# Altium schematic sheet STM32_DAQ_Control_Board.SchDoc
size 297 x 209 mm; Symbol: Drawing-Symbol_A4; Company: 嘉立创EDA; Version: V1.0; Page Size: A4; @Project Name: stm32系统版; @Update Date: 2026-07-07; @Create Date: 2026-07-07; Device: Drawing-Symbol_A4; @Board Name: Board1; @Page Name: P1; @Create Time: 19:32:34; @Page Count: 1; @Page No: 1; @Schematic Name: Schematic1; @Update Time: 19:32:34; @Assembly Variant: Basic; Border: 1; Title Block Position: 3; Size: A4; Width: 1170; Height: 825; Region Start: 1; X Region Count: 6; Y Region Count: 4; Blade Width: 10; SheetNumber: 1; SheetTotal: 1
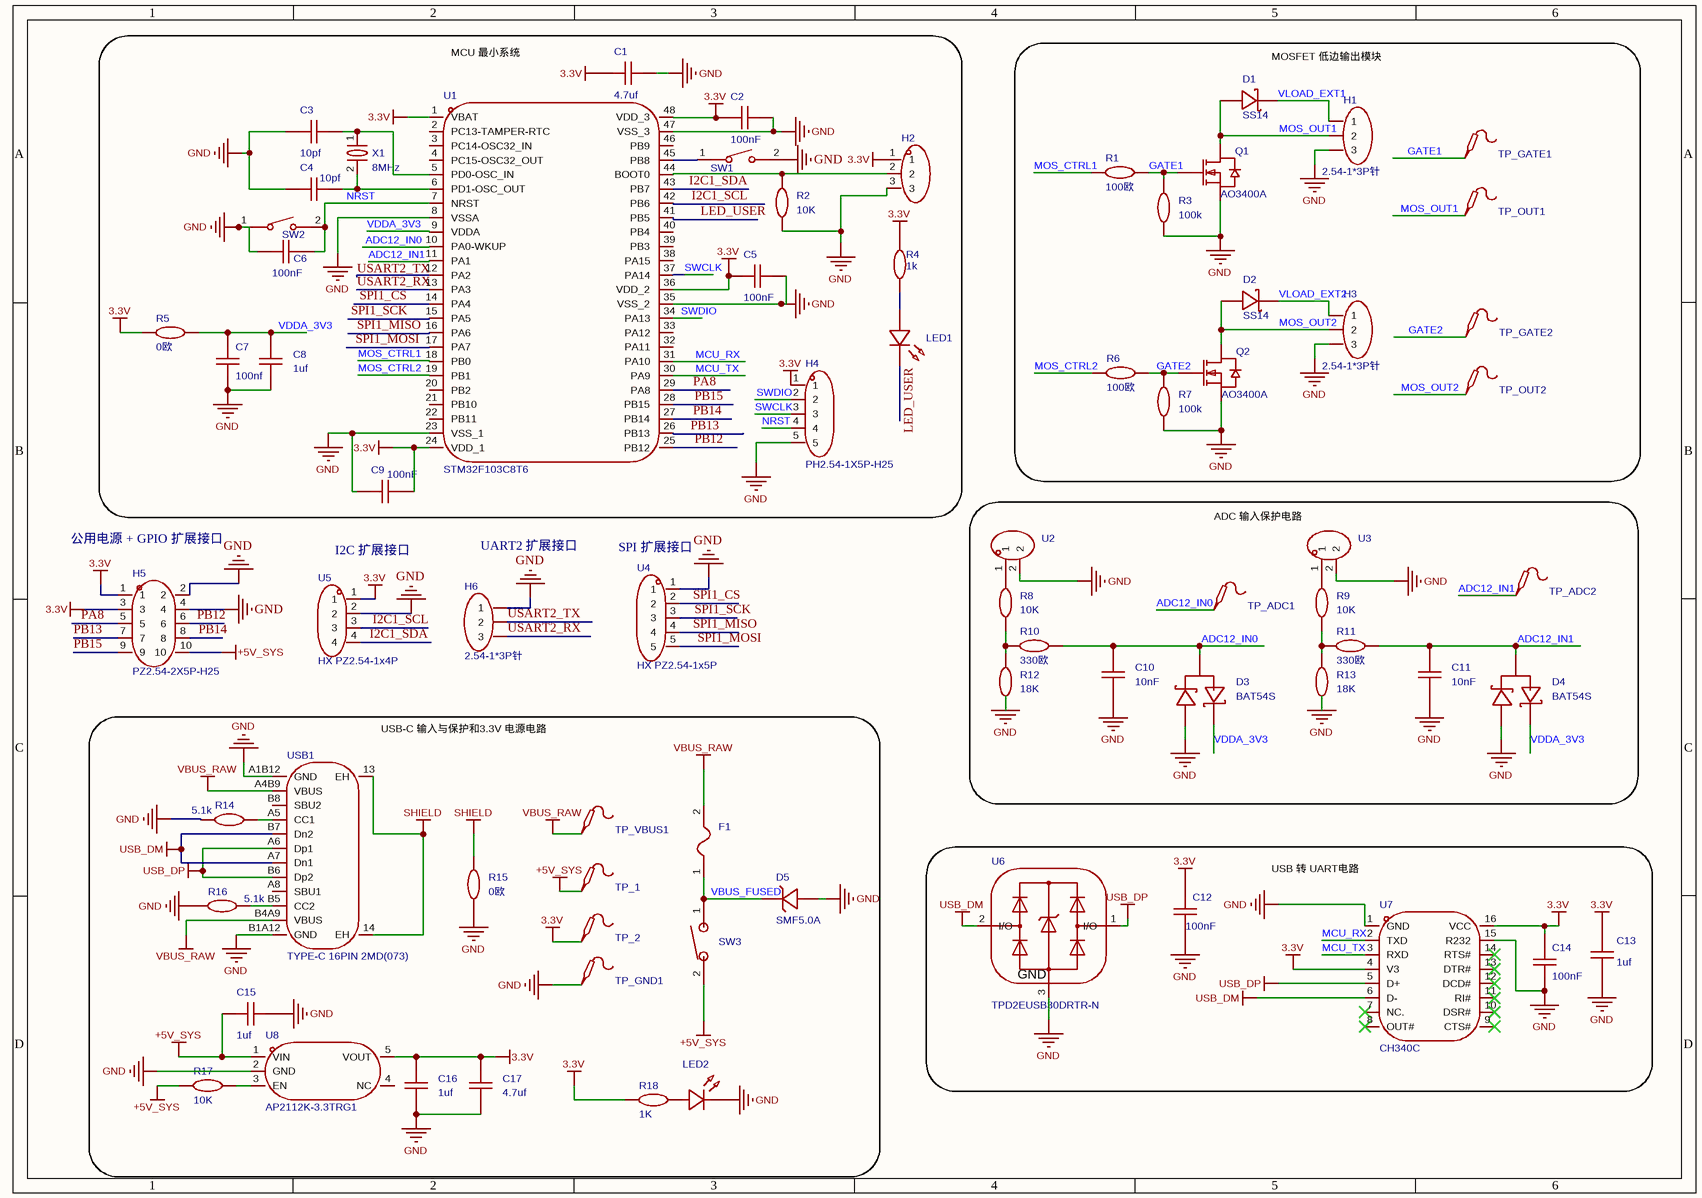
[diagram p0: STM32_DAQ_Control_Board.SchDoc]

## Parts
C1  4.7uf  [C0603]
C2  100nF  [C0603]
C3  10pf  [C0603]
C4  10pf  [C0603]
C5  100nF  [C0603]
C6  100nF  [C0603]
C7  100nf  [C0603]
C8  1uf  [C0603]
C9  100nF  [C0603]
C10  10nF  [C0603]
C11  10nF  [C0603]
C12  100nF  [C0603]
C13  1uf  [C0603]
C14  100nF  [C0603]
C15  1uf  [C0603]
C16  1uf  [C0603]
C17  4.7uf  [C0603]
D1  SS14  [SMA_L4.3-W2.6-LS5.2-RD]
D2  SS14  [SMA_L4.3-W2.6-LS5.2-RD]
D3  BAT54S  [SOT-23-3_L2.9-W1.3-P1.90-LS2.4-BR]
D4  BAT54S  [SOT-23-3_L2.9-W1.3-P1.90-LS2.4-BR]
D5  SMF5.0A  [SOD-123FL_L2.7-W1.8-LS3.8-RD]
F1  SMD0805-050-6  [F0805]  (value not drawn)
H1  2.54-1*3P针  [HDR-TH_3P-P2.54-V-M-1]
H2  HX PZ2.54-1x3P ZZ  [CONN-TH_HX-PZ2.54-1X3P-ZZ]  (value not drawn)
H3  2.54-1*3P针  [HDR-TH_3P-P2.54-V-M-1]
H4  PH2.54-1X5P-H25  [HDR-TH_5P-P2.54-V-M-3]
H5  PZ2.54-2X5P-H25  [HDR-TH_10P-P2.54-V-M-R2-C5-S2.54_2]
H6  2.54-1*3P针  [HDR-TH_3P-P2.54-V-M-1]
LED1  GL0603UR01  [LED0603-FD]  (value not drawn)
LED2  GL0603UR01  [LED0603-FD]  (value not drawn)
Q1  AO3400A  [SOT-23-3_L2.9-W1.3-P1.90-LS2.4-BR]
Q2  AO3400A  [SOT-23-3_L2.9-W1.3-P1.90-LS2.4-BR]
R1  100欧  [R0603]
R2  10K  [R0603]
R3  100k  [R0603]
R4  1k  [R0603]
R5  0欧  [R0603]
R6  100欧  [R0603]
R7  100k  [R0603]
R8  10K  [R0603]
R9  10K  [R0603]
R10  330欧  [R0603]
R11  330欧  [R0603]
R12  18K  [R0603]
R13  18K  [R0603]
R14  5.1k  [R0603]
R15  0欧  [R0603]
R16  5.1k  [R0603]
R17  10K  [R0603]
R18  1K  [R0603]
SW1  TS-1088-AR02016  [SW-SMD_L3.9-W3.0-P4.45]  (value not drawn)
SW2  TS-1088-AR02016  [SW-SMD_L3.9-W3.0-P4.45]  (value not drawn)
SW3  RS601HL-1010011BB  [SW-TH_RS601HL-1010011BB]  (value not drawn)
TP_1  (no value)  [Test-Point-0.5mm]
TP_2  (no value)  [Test-Point-0.5mm]
TP_ADC1  (no value)  [Test-Point-0.5mm]
TP_ADC2  (no value)  [Test-Point-0.5mm]
TP_GATE1  (no value)  [Test-Point-0.5mm]
TP_GATE2  (no value)  [Test-Point-0.5mm]
TP_GND1  (no value)  [Test-Point-0.5mm]
TP_OUT1  (no value)  [Test-Point-0.5mm]
TP_OUT2  (no value)  [Test-Point-0.5mm]
TP_VBUS1  (no value)  [Test-Point-0.5mm]
U1  STM32F103C8T6  [LQFP-48_L7.0-W7.0-P0.50-LS9.0-BL]
U2  HX PZ2.54-1x2P ZZ  [HDR-TH_2P-P2.54-V-M-3]  (value not drawn)
U3  HX PZ2.54-1x2P ZZ  [HDR-TH_2P-P2.54-V-M-3]  (value not drawn)
U4  HX PZ2.54-1x5P  [HDR-TH_5P-P2.54-V-M]
U5  HX PZ2.54-1x4P  [HDR-TH_4P-P2.54-V-M]
U6  TPD2EUSB30DRTR-N  [SOT-723_L1.2-W0.8-P0.40-LS1.2-BR]
U7  CH340C  [SOP-16_L10.0-W3.9-P1.27-LS6.0-BL]
U8  AP2112K-3.3TRG1  [SOT-25-5_L2.9-W1.6-P0.95-LS2.8-BL]
USB1  TYPE-C 16PIN 2MD(073)  [USB-C-SMD_TYPE-C-16PIN-2MD-073]
X1  8MHz  [CRYSTAL-SMD_L5.0-W3.2]

## Blocks framed on the sheet
MCU 最小系统: C1-C9 H2 H4 LED1 R2 R4 R5 SW1 SW2 U1 X1
MOSFET 低边输出模块: D1 D2 H1 H3 Q1 Q2 R1 R3 R6 R7 TP_GATE1 TP_GATE2 TP_OUT1 TP_OUT2
ADC 输入保护电路: C10 C11 D3 D4 R8-R13 TP_ADC1 TP_ADC2 U2 U3
USB-C 输入与保护和3.3V 电源电路: C15-C17 D5 F1 LED2 R14-R18 SW3 TP_1 TP_2 TP_GND1 TP_VBUS1 U8 USB1
USB 转 UART电路: C12-C14 U6 U7

## Nets
3.3V: C1.2 C2.1 C5.1 C9.2 C12.2 C13.2 C14.2 C16.1 C17.1 H2.1 H4.1 H5.1 H5.3 R4.2 R5.1 R18.2 TP_2.1 U1.1(VBAT) U1.24(VDD_1) U1.36(VDD_2) U1.48(VDD_3) U5.1 U7.4(V3) U7.16(VCC) U8.5(VOUT)
+5V_SYS: C15.1 H5.10 R17.1 SW3.2 TP_1.1 U8.1(VIN)
GND: C1.1 C2.2 C3.1 C4.1 C5.2 C6.1 C7.1 C8.1 C9.1 C10.1 C11.1 C12.1 C13.1 C14.1 C15.2 C16.2 C17.2 D3.1(K1) D4.1(K1) D5.2(A) H1.3 H2.3 H3.3 H4.5 H5.2 H5.4 H6.1 LED2.2(C) Q1.2(S) Q2.2(S) R2.2 R3.1 R7.1 R12.2 R13.2 R14.1 R15.1 R16.1 SW1.2 SW2.1 TP_GND1.1 U1.8(VSSA) U1.23(VSS_1) U1.35(VSS_2) U1.47(VSS_3) U2.2 U3.2 U4.1 U5.2 U6.3(GND) U7.1(GND) U7.15(R232) U8.2(GND) USB1.A1B12(GND) USB1.B1A12(GND)
SHIELD: R15.2 USB1.13(EH) USB1.14(EH)
USB_DM: U6.2(I/O) U7.6(D-) USB1.A7(Dn1) USB1.B7(Dn2)
USB_DP: U6.1(I/O) U7.5(D+) USB1.A6(Dp1) USB1.B6(Dp2)
VBUS_RAW: F1.2 TP_VBUS1.1 USB1.A4B9(VBUS) USB1.B4A9(VBUS)
ADC12_IN0: C10.2 D3.3(A) R10.1 TP_ADC1.1 U1.10(PA0-WKUP)
ADC12_IN1: C11.2 D4.3(A) R11.1 TP_ADC2.1 U1.11(PA1)
GATE1: Q1.1(G) R1.2 R3.2 TP_GATE1.1
GATE2: Q2.1(G) R6.2 R7.2 TP_GATE2.1
I2C1_SCL: U1.42(PB6) U5.3
I2C1_SDA: U1.43(PB7) U5.4
LED_USER: LED1.2(C) U1.41(PB5)
MCU_RX: U1.31(PA10) U7.2(TXD)
MCU_TX: U1.30(PA9) U7.3(RXD)
MOS_CTRL1: R1.1 U1.18(PB0)
MOS_CTRL2: R6.1 U1.19(PB1)
MOS_OUT1: D1.2(A) H1.2 Q1.3(D) TP_OUT1.1
MOS_OUT2: D2.2(A) H3.2 Q2.3(D) TP_OUT2.1
NRST: C6.2 H4.4 SW2.2 U1.7(NRST)
PA8: H5.5 U1.29(PA8)
PB12: H5.6 U1.25(PB12)
PB13: H5.7 U1.26(PB13)
PB14: H5.8 U1.27(PB14)
PB15: H5.9 U1.28(PB15)
SPI1_CS: U1.14(PA4) U4.2
SPI1_MISO: U1.16(PA6) U4.4
SPI1_MOSI: U1.17(PA7) U4.5
SPI1_SCK: U1.15(PA5) U4.3
SWCLK: H4.3 U1.37(PA14)
SWDIO: H4.2 U1.34(PA13)
USART2_RX: H6.3 U1.13(PA3)
USART2_TX: H6.2 U1.12(PA2)
VBUS_FUSED: D5.1(K) F1.1 SW3.1
VDDA_3V3: C7.2 C8.2 D3.2(K2) D4.2(K2) R5.2 U1.9(VDDA)
VLOAD_EXT1: D1.1(K) H1.1
VLOAD_EXT2: D2.1(K) H3.1
NetC3_2: C3.2 U1.5(PD0-OSC_IN) X1.1
NetC4_2: C4.2 U1.6(PD1-OSC_OUT) X1.2(GND)
NetH2_2: H2.2 R2.1 U1.44(BOOT0)
NetLED1_1: LED1.1(A) R4.1
NetR8_1: R8.1 U2.1
NetR8_2: R8.2 R10.2 R12.1
NetR9_1: R9.1 U3.1
NetR9_2: R9.2 R11.2 R13.1
NetR14_2: R14.2 USB1.A5(CC1)
NetR16_2: R16.2 USB1.B5(CC2)
NetR17_2: R17.2 U8.3(EN)
NetSW1_1: SW1.1 U1.45(PB8)

Not connected (* = marked no-connect by the designer): LED2 1(A); R18 1; U1 2(PC13-TAMPER-RTC) 3(PC14-OSC32_IN) 4(PC15-OSC32_OUT) 20(PB2) 21(PB10) 22(PB11) 32(PA11) 33(PA12) 38(PA15) 39(PB3) 40(PB4) 46(PB9); U7 7(NC.)* 8(OUT#)* 9(CTS#)* 10(DSR#)* 11(RI#)* 12(DCD#)* 13(DTR#)* 14(RTS#)*; U8 4(NC); USB1 A8(SBU1) B8(SBU2)

## Notes on the sheet
- (near H5) 公用电源 + GPIO 扩展接口
- I2C 扩展接口
- (near H6) UART2 扩展接口
- (near U4) SPI 扩展接口

## Library data of the parts
C1-C9 C15-C17 = CAP_0603: Symbol: Capacitance; ConvertToPcb: yes; ModelId: ac125912035d415993ca9572d50418b1聨0819f05c4eef4c71ace90d822a990e87; ModelName: C0603_L1.6-W0.8-H0.8; ModelTransform: 62.992,31.496,0,0,0,0,0,0,0; Device: CAP_0603; AddInBom: yes; Supplier Footprint: 0603; FootprintName: C0603
  C1 C17: Value: 4.7uf
  C2 C5 C6 C9: Value: 100nF
  C3 C4: Value: 10pf
  C7: Value: 100nf
  C8 C15 C16: Value: 1uf
C10-C14 = CAP_0603: Symbol: Capacitance; 3D Model: ac125912035d415993ca9572d50418b1聨0819f05c4eef4c71ace90d822a990e87; 3D Model Transform: 62.992,31.496,0,0,0,0,0,0,0; ConvertToPcb: yes; ModelName: C0603_L1.6-W0.8-H0.8; Device: CAP_0603; Supplier Footprint: 0603; AddInBom: yes; FootprintName: C0603
  C10 C11: Value: 10nF
  C12 C14: Value: 100nF
  C13: Value: 1uf
D1 D2 = SS14_C83852: 正向压降(Vf):500mV@1A;直流反向耐压(Vr):40V;整流电流:1A;; Manufacturer: onsemi(安森美); AddInBom: yes; ModelId: e3551acb3c5a4975a5e9d36087fe1fa2聨0819f05c4eef4c71ace90d822a990e87; ModelTransform: 185.039,102.362,0,0,0,0,0,0,0; Voltage - DC Reverse(Vr): 40V; Current - Rectified: 1A; Reverse Leakage Current (Ir): 200uA@40V; Operating Junction Temperature Range: -65℃~+125℃; Non-Repetitive Peak Forward Surge Current: 40A; Symbol: SS14_C83852; Device: SS14_C83852; LCSC Part Name: 电压:40V 电流:1A; SupplierPart: C83852; ManufacturerPart: SS14; Supplier Footprint: SMA(DO-214AC); JLCPCB Part Class: Extended Part; Datasheet: https://item.szlcsc.com/datasheet/SS14/85019.html; Supplier: LCSC; ConvertToPcb: yes; FootprintName: SMA_L4.3-W2.6-LS5.2-RD; ModelName: SMA_L4.3-W2.6-LS5.2-RD; Voltage - Forward(Vf@If): 500mV@1A
D3 D4 = BAT54S_C7420333: 二极管配置:1对串联式;正向压降(Vf):400mV@10mA;直流反向耐压(Vr):30V;整流电流:200mA;; Manufacturer: R+O(宏嘉诚); AddInBom: yes; ModelId: c62791f0466c4ae2a892c056b845b0ca聨0819f05c4eef4c71ace90d822a990e87; ModelName: SOT-23-3P_L2.9-W1.3-H1.0-LS2.4-P0.95; ModelTransform: 98.425,114.173,0,180,0,0,0.0005,-0.0005,0; Diode Configuration: 1对串联式; Voltage - DC Reverse(Vr): 30V; Current - Rectified: 200mA; Reverse Leakage Current (Ir): 2uA@30V; Non-Repetitive Peak Forward Surge Current: 600mA; Symbol: BAT54S_C7420333; Device: BAT54S_C7420333; LCSC Part Name: 电压:30V 电流:200mA; SupplierPart: C7420333; ManufacturerPart: BAT54S; Supplier Footprint: SOT-23; JLCPCB Part Class: Extended Part; Datasheet: https://item.szlcsc.com/datasheet/BAT54S/8397155.html; Supplier: LCSC; ConvertToPcb: yes; FootprintName: SOT-23-3_L2.9-W1.3-P1.90-LS2.4-BR; Voltage - Forward(Vf@If): 400mV@10mA
D5 = SMF5.0A_C19077497: 极性:单向;反向截止电压(Vrwm):5V;钳位电压:9.2V;峰值脉冲电流(Ipp):21.7A@10/1000us;峰值脉冲功率(Ppp):200W@10/1000us;击穿电压:7V;; Manufacturer: R+O(宏嘉诚); AddInBom: yes; ModelId: 86f9151e155e4fe2af0c4f2e0a80302e聨0819f05c4eef4c71ace90d822a990e87; ModelName: SOD-123FL_L2.8-W1.8-H1.1-LS3.6; ModelTransform: 141.732,70.866,0,180,0,0,0,0,0; Polarity: 单向; Reverse Stand-Off Voltage (Vrwm): 5V; Clamping Voltage: 9.2V; Voltage - Breakdown: 7V; Reverse Leakage Current (Ir): 400uA; Number of Channels: 单路; level of protection: IEC 61000-4-2; Type: TVS; Symbol: SMF5.0A_C19077497; Device: SMF5.0A_C19077497; LCSC Part Name: 单向TVS 5V截止 峰值浪涌电流：21.7A@10/1000us; SupplierPart: C19077497; ManufacturerPart: SMF5.0A; Supplier Footprint: SOD-123FL; JLCPCB Part Class: Extended Part; Datasheet: https://item.szlcsc.com/datasheet/SMF5.0A/20275582.html; Supplier: LCSC; ConvertToPcb: yes; FootprintName: SOD-123FL_L2.7-W1.8-LS3.8-RD; Peak Pulse Current (Ipp): 21.7A@10/1000us; Peak Pulse Power Dissipation (Ppp): 200W@10/1000us; Operating Temperature: -55℃~+150℃; Junction Capacitance: -
F1 = SMD0805-050-6: 耐压(Vmax):6V;最大电流(Imax):40A;保持电流(Ihold):500mA;跳闸电流(Itrip):1A;; Manufacturer: R+O(宏嘉诚); AddInBom: yes; ModelId: 57e2aa106f9143e8b6ab832aebb31c78聨0819f05c4eef4c71ace90d822a990e87; ModelName: F0805_L2.1-W1.4-H0.8; ModelTransform: 82.677,55.118,0,0,0,0,0.0005,0,0; Voltage - Max: 6V; Current - Max: 40A; Hold Current: 500mA; Trip Current: 1A; Power Dissipation: 500mW; Resistance - Initial (Ri) (Min): 100mΩ; Resistance - Post Trip (R1) (Max): 850mΩ; Time to Trip(Max): 100ms; Symbol: SMD0805-050-6; Device: SMD0805-050-6; LCSC Part Name: 6V 500mA; SupplierPart: C46640983; ManufacturerPart: SMD0805-050-6; Supplier Footprint: 0805; JLCPCB Part Class: Extended Part; Datasheet: https://item.szlcsc.com/datasheet/SMD0805-050-6/48798689.html; Supplier: LCSC; ConvertToPcb: yes; FootprintName: F0805; Operating Temperature: -40℃~+85℃; Length: 2.2mm; Width: 1.5mm; Height: 0.8mm
H1 H3 H6 = 2.54-1*3P针: 插针结构:1x3P;间距:2.54mm;行距:-;圆针/方针:方针;安装方式:直插;排数:单排;总PIN位数:3P;额定电流:3A;额定电压:-;配合针长度:6mm;塑高:2.5mm;端接针长度:3mm;触头材质:黄铜;触头镀层:金;工作温度:-40℃~+105℃;颜色:黑色;; Manufacturer: BOOMELE(博穆精密); Symbol: Header-Male-2.54_1x3; AddInBom: yes; ModelId: 94a8ffe137b6410295cb18cd3ffd99db聨0819f05c4eef4c71ace90d822a990e87; ModelName: HDR-M-2.54_1x3; ModelTransform: 299.9994,100,0,0,0,0,0,0,-118.11; Pin Structure: 1x3P; Pitch: 2.54mm; Circluar Pins/Square Pins: 方针; Current Rating: 3A; Device: 2.54-1*3P针; LCSC Part Name: 1x3P 间距:2.54mm 方针 直插; SupplierPart: C49257; ManufacturerPart: 2.54-1*3P针; Supplier Footprint: 插件,P=2.54mm; JLCPCB Part Class: Extended Part; Datasheet: https://item.szlcsc.com/datasheet/2.54-1*3P%25E9%2592%2588/50265.html; Supplier: LCSC; ConvertToPcb: yes; FootprintName: HDR-TH_3P-P2.54-V-M-1; Row Spacing: -; Mounting Type: 直插; Number of Rows: 单排; Number of Pins: 3P; Voltage Rating (Max): -; Length of Mating Pin: 6mm; Insulation Height: 2.5mm; Length of End Connection Pin: 3mm; Contact Material: 黄铜; Contact Plating: 金; Operating Temperature: -40℃~+105℃; Color: 黑色
H2 = HX PZ2.54-1x3P ZZ: 插针结构:1x3P;间距:2.54mm;行距:-;圆针/方针:方针;安装方式:直插;排数:单排;总PIN位数:3P;额定电流:3A;额定电压:1kV;配合针长度:6mm;塑高:2.5mm;端接针长度:3mm;触头材质:黄铜;触头镀层:金;工作温度:-40℃~+105℃;颜色:黑色;; Manufacturer: hanxia(韩下); AddInBom: yes; ModelId: d100cf23e3504114ab0fced37a4e4a82聨0819f05c4eef4c71ace90d822a990e87; ModelTransform: 292.5191,98.425,0,0,0,0,0,0,-118.11; Pin Structure: 1x3P; Pitch: 2.54mm; Circluar Pins/Square Pins: 方针; Current Rating: 3A; Voltage Rating (Max): 1kV; Symbol: HX PZ2.54-1X3P ZZ; Device: HX PZ2.54-1x3P ZZ; LCSC Part Name: 1x3P 间距:2.54mm 方针 直插; SupplierPart: C32713269; ManufacturerPart: HX PZ2.54-1x3P ZZ; Supplier Footprint: 插件,P=2.54mm; JLCPCB Part Class: Extended Part; Datasheet: https://item.szlcsc.com/datasheet/HX%2520PZ2.54-1x3P%2520ZZ/34444549.html; Supplier: LCSC; ConvertToPcb: yes; FootprintName: CONN-TH_HX-PZ2.54-1X3P-ZZ; ModelName: CONN-TH_HX-PZ2.54-1X3P-ZZ; Row Spacing: -; Mounting Type: 直插; Number of Rows: 单排; Number of Pins: 3P; Length of Mating Pin: 6mm; Insulation Height: 2.5mm; Length of End Connection Pin: 3mm; Contact Material: 黄铜; Contact Plating: 金; Operating Temperature: -40℃~+105℃; Color: 黑色; Supplementary Features: -
H4 = PH2.54-1X5P-H25: 插针结构:1x5P;间距:2.54mm;行距:-;圆针/方针:方针;安装方式:直插;排数:单排;总PIN位数:5P;额定电流:3A;额定电压:-;配合针长度:6mm;塑高:2.5mm;端接针长度:3mm;触头材质:黄铜;触头镀层:金;工作温度:-40℃~+105℃;颜色:黑色;; Manufacturer: JXTCONN(聚兴泰); AddInBom: yes; ModelId: 70c2fce3a47c4ce6bc0418a805e76a28聨0819f05c4eef4c71ace90d822a990e87; ModelTransform: 500.3927,98.425,0,0,0,0,0,0,-118.11; Pin Structure: 1x5P; Pitch: 2.54mm; Circluar Pins/Square Pins: 方针; Current Rating: 3A; Symbol: PH2.54-1X5P-H25; Device: PH2.54-1X5P-H25; LCSC Part Name: 1x5P 间距:2.54mm 方针 直插; SupplierPart: C42431835; ManufacturerPart: PH2.54-1X5P-H25; Supplier Footprint: 插件,P=2.54mm; JLCPCB Part Class: Extended Part; Datasheet: https://item.szlcsc.com/datasheet/PH2.54-1X5P-H25/44458965.html; Supplier: LCSC; ConvertToPcb: yes; FootprintName: HDR-TH_5P-P2.54-V-M-3; ModelName: HDR-TH_5P-P2.54-V-M-3; Row Spacing: -; Mounting Type: 直插; Number of Rows: 单排; Number of Pins: 5P; Voltage Rating (Max): -; Length of Mating Pin: 6mm; Insulation Height: 2.5mm; Length of End Connection Pin: 3mm; Contact Material: 黄铜; Contact Plating: 金; Operating Temperature: -40℃~+105℃; Color: 黑色
H5 = PZ2.54-2X5P-H25: 插针结构:2x5P;间距:2.54mm;行距:2.54mm;圆针/方针:方针;安装方式:直插;排数:双排;总PIN位数:10P;额定电流:3A;额定电压:-;配合针长度:6mm;塑高:2.5mm;端接针长度:3mm;触头材质:黄铜;触头镀层:金;工作温度:-40℃~+105℃;颜色:黑色;; Manufacturer: JXTCONN(聚兴泰); AddInBom: yes; ModelId: 06d0967b89884158823d1be712bed3d1聨0819f05c4eef4c71ace90d822a990e87; ModelTransform: 500.393,200,0,0,0,0,0,0,-196.85; Pin Structure: 2x5P; Pitch: 2.54mm; Circluar Pins/Square Pins: 方针; Current Rating: 3A; Symbol: PZ2.54-2X5P-H25; Device: PZ2.54-2X5P-H25; LCSC Part Name: 2x5P 间距:2.54mm 方针 直插; SupplierPart: C42431818; ManufacturerPart: PZ2.54-2X5P-H25; Supplier Footprint: 插件,P=2.54mm; JLCPCB Part Class: Extended Part; Datasheet: https://item.szlcsc.com/datasheet/PZ2.54-2X5P-H25/44458948.html; Supplier: LCSC; ConvertToPcb: yes; FootprintName: HDR-TH_10P-P2.54-V-M-R2-C5-S2.54_2; ModelName: HDR-TH_10P-P2.54-V-M-R2-C5-S2.54_2; Row Spacing: 2.54mm; Mounting Type: 直插; Number of Rows: 双排; Number of Pins: 10P; Voltage Rating (Max): -; Length of Mating Pin: 6mm; Insulation Height: 2.5mm; Length of End Connection Pin: 3mm; Contact Material: 黄铜; Contact Plating: 金; Operating Temperature: -40℃~+105℃; Color: 黑色
LED1 LED2 = GL0603UR01: 灯头类型:-;发光颜色:红色;正向压降(Vf):2.4V;功率:-;正向电流:20mA;波长:620nm~625nm;二极管配置:独立二极管;透镜颜色:无色透明透镜;色温:-;发光强度:120mcd;发光角度:120°;载带方式:正贴;工作温度:-40℃~+85℃;; Manufacturer: Guiguang light(桂光光电); AddInBom: yes; ModelId: b57d6965da4c4e30afc1a994a1f136ae聨0819f05c4eef4c71ace90d822a990e87; ModelName: LED0603_Inf; ModelTransform: 60,30,0,0,0,0,0,0,0; Illumination Color: 红色; Voltage - Forward(Vf): 2.4V; Forward Current: 20mA; Diode Configuration: 独立二极管; Lens Color: 无色透明透镜; Luminous Intensity: 120mcd; Viewing Angle: 120°; Symbol: GL0603UR01; Device: GL0603UR01; LCSC Part Name: 0603 红灯 高亮; SupplierPart: C51933292; ManufacturerPart: GL0603UR01; Supplier Footprint: 0603; JLCPCB Part Class: Extended Part; Datasheet: https://item.szlcsc.com/datasheet/GL0603UR01/54645988.html; Supplier: LCSC; ConvertToPcb: yes; FootprintName: LED0603-FD; Lamp Holder Type: -; Power(Watts): -; Wavelength - Dominant: 620nm~625nm; Peak Wavelength: -; Color Temperature: -; Mounting Style: 正贴; Operating Temperature: -40℃~+85℃
Q1 Q2 = AO3400A_C20917: 数量:-;漏源电压(Vdss):30V;连续漏极电流(Id):-;导通电阻(RDS(on)):48mΩ@2.5V;耗散功率(Pd):-;阈值电压(Vgs(th)):1.45V@250uA;; Manufacturer: AOS; AddInBom: yes; ModelId: c62791f0466c4ae2a892c056b845b0ca聨0819f05c4eef4c71ace90d822a990e87; ModelName: SOT-23-3P_L2.9-W1.3-H1.0-LS2.4-P0.95; ModelTransform: 98.425,114.173,0,180,0,0,0.0005,-0.0005,0; Drain to Source Voltage: 30V; Gate Charge(Qg): 7nC@10V; Input Capacitance(Ciss): 630pF@15V; Type: N沟道; Symbol: AO3400A; Device: AO3400A_C20917; LCSC Part Name: 1个N沟道 耐压:30V 电流:5.7A; SupplierPart: C20917; ManufacturerPart: AO3400A; Supplier Footprint: SOT-23-3L; JLCPCB Part Class: Basic Part; Datasheet: https://item.szlcsc.com/datasheet/AO3400A/21629.html; Supplier: LCSC; ConvertToPcb: yes; FootprintName: SOT-23-3_L2.9-W1.3-P1.90-LS2.4-BR; Number: -; Current - Continuous Drain(Id): -; RDS(on): 48mΩ@2.5V; Pd - Power Dissipation: -; Gate Threshold Voltage (Vgs(th)): 1.45V@250uA; Reverse Transfer Capacitance (Crss@Vds): -; Operating Temperature: -55℃~+150℃@(Tj); Configuration: -; Output Capacitance(Coss): -
R1 R3 R6-R13 = Res_0603: Symbol: 电阻; 3D Model: fc143cca1e79419f9cd78b61e9279f08聨0819f05c4eef4c71ace90d822a990e87; 3D Model Transform: 31.8897,63.7794,0,90,0,0,0,0,0; ConvertToPcb: yes; Device: Res_0603; Supplier Footprint: 0603; AddInBom: yes; FootprintName: R0603; ModelName: R0603
  R1 R6: Value: 100欧
  R3 R7: Value: 100k
  R8 R9: Value: 10K
  R10 R11: Value: 330欧
  R12 R13: Value: 18K
R2 R5 R14-R18 = Res_0603: Symbol: 电阻; ConvertToPcb: yes; ModelId: fc143cca1e79419f9cd78b61e9279f08聨0819f05c4eef4c71ace90d822a990e87; ModelTransform: 31.8897,63.7794,0,90,0,0,0,0,0; Device: Res_0603; AddInBom: yes; Supplier Footprint: 0603; FootprintName: R0603; ModelName: R0603
  R2 R17: Value: 10K
  R5 R15: Value: 0欧
  R14 R16: Value: 5.1k
  R18: Value: 1K
R4 = Res_0603_1: Symbol: 电阻; ConvertToPcb: yes; ModelId: fc143cca1e79419f9cd78b61e9279f08聨0819f05c4eef4c71ace90d822a990e87; ModelTransform: 31.8897,63.7794,0,90,0,0,0,0,0; Value: 10K; Device: Res_0603; AddInBom: yes; Supplier Footprint: 0603; FootprintName: R0603; ModelName: R0603
SW1 SW2 = TS-1088-AR02016: 电路结构:单刀单掷;按钮形状:圆形按钮;作用力:1.6N;安装方式:立贴;开关长度:3.9mm;开关宽度:3mm;开关高度:2mm;带支架:不带支架;触点电流:50mA;额定电压:12V;带灯:-;工作寿命:10万次;; Manufacturer: XUNPU(讯普); AddInBom: yes; ModelId: b26698b69f274ffabef8a26c7d0e5dd1聨0819f05c4eef4c71ace90d822a990e87; ModelName: SW-SMD_L3.9-W2.9-H2.0-LS4.8; ModelTransform: 188.976,114.174,0,0,0,0,0,0,0; Circuit: 单刀单掷; Actuator Style: 圆形按钮; Operating Force: 1.6N; Switch Height: 2mm; with Bracket: 不带支架; Contact Current: 50mA; Voltage Rating: 12V; Actuator/Cap Color: 黑色; Life: 10万次; Symbol: TS-1088-AR02016; Device: TS-1088-AR02016; LCSC Part Name: 3.9*3*2mm 立贴 轻触开关; SupplierPart: C720477; ManufacturerPart: TS-1088-AR02016; Supplier Footprint: SMD,4x3mm; JLCPCB Part Class: Basic Part; Datasheet: https://item.szlcsc.com/datasheet/TS-1088-AR02016/763484.html; Supplier: LCSC; ConvertToPcb: yes; FootprintName: SW-SMD_L3.9-W3.0-P4.45; Mounting Type: 立贴; Length: 3.9mm; Width: 3mm; With Lamp: -; IP Rating: -; Termination Style: SMD接片; Operating Temperature: -30℃~+80℃
SW3 = RS601HL-1010011BB: 带灯:无;引脚样式:焊片;额定电流:3A;额定电压(AC):250V;额定电压(DC):-;电路结构:单刀单掷;工作寿命:1万次;; Manufacturer: HCTL(华灿天禄); AddInBom: yes; ModelId: cac6664e7827407e8024fa0ea95caa3c聨0819f05c4eef4c71ace90d822a990e87; ModelTransform: 590.55,413.385,0,0,0,0,97.83,0,-196.85; Actuator Type: 凹面弯曲; With Lamp: 无; Actuator Color: 黑色; Current Rating: 3A; Voltage Rating (AC): 250V; Circuit: 单刀单掷; Life: 1万次; Actuator Identifier: - O; Symbol: RS601HL-1010011BB; Device: RS601HL-1010011BB; LCSC Part Name: RS601HL-1010011BB; SupplierPart: C2885782; ManufacturerPart: RS601HL-1010011BB; Supplier Footprint: 插件,15x10.5mm; JLCPCB Part Class: Extended Part; Datasheet: https://item.szlcsc.com/datasheet/RS601HL-1010011BB/3096684.html; Supplier: LCSC; ConvertToPcb: yes; FootprintName: SW-TH_RS601HL-1010011BB; ModelName: SW-TH_RS601HL-1010011BB; Length: 15mm; Width: 10.5mm; Switch Height: -; Termination Style: 焊片; Voltage Rating (DC): -; Operating Temperature: -25℃~+85℃
TP_1 TP_2 TP_ADC1 TP_ADC2 TP_GATE1 TP_GATE2 TP_GND1 TP_OUT1 TP_OUT2 TP_VBUS1 = Test-Point: Test Point 测试点; AddInBom: yes; Symbol: Test-Point; Device: Test-Point; ConvertToPcb: yes; FootprintName: Test-Point-0.5mm
U1 = STM32F103C8T6: CPU内核:ARM-M3;CPU最大主频:72MHz;应用领域:-;; Manufacturer: ST(意法半导体); AddInBom: yes; ModelId: 093be70396ff421eb2cdb946d5311efc聨0819f05c4eef4c71ace90d822a990e87; ModelName: LQFP-48_L7.0-W7.0-H1.4-LS9.0-P0.50; ModelTransform: 354.331,354.331,0,0,0,0,0,0,0; CPU Core: ARM-M3; CPU Maximum Speed: 72MHz; Program Storage Size: 64KB; Program Memory Type: FLASH; Number of I/O: 37; ADC (Bit): 12bit; Voltage - Supply: 2V~3.6V; Symbol: STM32F103C8T6; Device: STM32F103C8T6; LCSC Part Name: 主流增强型ARM Cortex-M3 MCU，具有64 KB Flash、72 MHz CPU、电机控制、USB和CAN; SupplierPart: C8734; ManufacturerPart: STM32F103C8T6; Supplier Footprint: LQFP-48(7x7); JLCPCB Part Class: Extended Part; Datasheet: https://item.szlcsc.com/datasheet/STM32F103C8T6/9243.html; Supplier: LCSC; ConvertToPcb: yes; FootprintName: LQFP-48_L7.0-W7.0-P0.50-LS9.0-BL; Applications: -
U2 U3 = HX PZ2.54-1x2P ZZ: 插针结构:1x2P;间距:2.54mm;行距:-;圆针/方针:方针;安装方式:直插;排数:单排;总PIN位数:2P;额定电流:3A;额定电压:1kV;配合针长度:6mm;塑高:2.5mm;端接针长度:3mm;触头材质:黄铜;触头镀层:金;工作温度:-40℃~+105℃;颜色:黑色;; Manufacturer: hanxia(韩下); AddInBom: yes; ModelId: c7a9f3c3e6e34627af2bf939e464cb35聨0819f05c4eef4c71ace90d822a990e87; ModelName: HDR-TH_2P-P2.54-M-LI-1X2P; ModelTransform: 200,100,0,0,0,0,0,0,-118.11; Pin Structure: 1x2P; Pitch: 2.54mm; Circluar Pins/Square Pins: 方针; Current Rating: 3A; Voltage Rating (Max): 1kV; Symbol: HX PZ2.54-1X2P ZZ; Device: HX PZ2.54-1x2P ZZ; LCSC Part Name: 1x2P 间距:2.54mm 方针 直插; SupplierPart: C32713268; ManufacturerPart: HX PZ2.54-1x2P ZZ; Supplier Footprint: 插件,P=2.54mm; JLCPCB Part Class: Extended Part; Datasheet: https://item.szlcsc.com/datasheet/HX%2520PZ2.54-1x2P%2520ZZ/34444548.html; Supplier: LCSC; ConvertToPcb: yes; FootprintName: HDR-TH_2P-P2.54-V-M-3; Row Spacing: -; Mounting Type: 直插; Number of Rows: 单排; Number of Pins: 2P; Length of Mating Pin: 6mm; Insulation Height: 2.5mm; Length of End Connection Pin: 3mm; Contact Material: 黄铜; Contact Plating: 金; Operating Temperature: -40℃~+105℃; Color: 黑色; Supplementary Features: -
U4 = HX PZ2.54-1x5P ZZ: 插针结构:1x5P;间距:2.54mm;行距:-;圆针/方针:方针;安装方式:直插;排数:单排;总PIN位数:5P;额定电流:3A;额定电压:1kV;配合针长度:6mm;塑高:2.5mm;端接针长度:3mm;触头材质:黄铜;触头镀层:金;工作温度:-40℃~+105℃;颜色:黑色;; Manufacturer: hanxia(韩下); AddInBom: yes; ModelId: 47d466e4a34f4fc5bc626cf773a24dd5聨0819f05c4eef4c71ace90d822a990e87; ModelName: HDR-TH_5P-P2.54-M-LI-1X5P; ModelTransform: 499.999,100,0,0,0,0,0,0,-118.11; Pin Structure: 1x5P; Pitch: 2.54mm; Circluar Pins/Square Pins: 方针; Current Rating: 3A; Voltage Rating (Max): 1kV; Symbol: HX PZ2.54-1X5P ZZ; Device: HX PZ2.54-1x5P ZZ; LCSC Part Name: 1x5P 间距:2.54mm 方针 直插; SupplierPart: C32713271; ManufacturerPart: HX PZ2.54-1x5P ZZ; Supplier Footprint: 插件,P=2.54mm; JLCPCB Part Class: Extended Part; Datasheet: https://item.szlcsc.com/datasheet/HX%2520PZ2.54-1x5P%2520ZZ/34444551.html; Supplier: LCSC; ConvertToPcb: yes; FootprintName: HDR-TH_5P-P2.54-V-M; Row Spacing: -; Mounting Type: 直插; Number of Rows: 单排; Number of Pins: 5P; Length of Mating Pin: 6mm; Insulation Height: 2.5mm; Length of End Connection Pin: 3mm; Contact Material: 黄铜; Contact Plating: 金; Operating Temperature: -40℃~+105℃; Color: 黑色; Supplementary Features: -
U5 = HX PZ2.54-1x4P ZZ: 插针结构:1x4P;间距:2.54mm;行距:-;圆针/方针:方针;安装方式:直插;排数:单排;总PIN位数:4P;额定电流:3A;额定电压:1kV;配合针长度:6mm;塑高:2.5mm;端接针长度:3mm;触头材质:黄铜;触头镀层:金;工作温度:-40℃~+105℃;颜色:黑色;; Manufacturer: hanxia(韩下); AddInBom: yes; ModelId: 112f4d05e8d64e99ab9a333894bea4f9聨0819f05c4eef4c71ace90d822a990e87; ModelName: HDR-TH_4P-P2.54-M-LI-1X4P; ModelTransform: 399.999,104.7242,0,0,0,0,0,0,-118.11; Pin Structure: 1x4P; Pitch: 2.54mm; Circluar Pins/Square Pins: 方针; Current Rating: 3A; Voltage Rating (Max): 1kV; Symbol: HX PZ2.54-1X4P ZZ; Device: HX PZ2.54-1x4P ZZ; LCSC Part Name: 1x4P 间距:2.54mm 方针 直插; SupplierPart: C32713270; ManufacturerPart: HX PZ2.54-1x4P ZZ; Supplier Footprint: 插件,P=2.54mm; JLCPCB Part Class: Extended Part; Datasheet: https://item.szlcsc.com/datasheet/HX%2520PZ2.54-1x4P%2520ZZ/34444550.html; Supplier: LCSC; ConvertToPcb: yes; FootprintName: HDR-TH_4P-P2.54-V-M; Row Spacing: -; Mounting Type: 直插; Number of Rows: 单排; Number of Pins: 4P; Length of Mating Pin: 6mm; Insulation Height: 2.5mm; Length of End Connection Pin: 3mm; Contact Material: 黄铜; Contact Plating: 金; Operating Temperature: -40℃~+105℃; Color: 黑色; Supplementary Features: -
U6 = TPD2EUSB30DRTR-N: 极性:单向;反向截止电压(Vrwm):5V;钳位电压:14V;峰值脉冲电流(Ipp):4A@8/20us;峰值脉冲功率(Ppp):56W@8/20us;击穿电压:6V;; Manufacturer: BORN(伯恩半导体); AddInBom: yes; ModelId: abccde1e67074d7481274a37cf5c97f0聨0819f05c4eef4c71ace90d822a990e87; ModelName: SOT-723-3P_L1.2-W0.8-H0.6-LS1.2-P0.40; ModelTransform: 47.244,47.244,0,180,0,0,0,0,0; Polarity: 单向; Reverse Stand-Off Voltage (Vrwm): 5V; Clamping Voltage: 14V; Voltage - Breakdown: 6V; Reverse Leakage Current (Ir): 100nA; level of protection: IEC 61000-4-4；IEC 61000-4-5；IEC 61000-4-2; Junction Capacitance: 0.6pF; Symbol: TPD2EUSB30DRTR-N; Device: TPD2EUSB30DRTR-N; LCSC Part Name: 单向ESD 5V截止 峰值浪涌电流：4A@8/20us; SupplierPart: C6165119; ManufacturerPart: TPD2EUSB30DRTR-N; Supplier Footprint: SOT-9X3; JLCPCB Part Class: Extended Part; Datasheet: https://item.szlcsc.com/datasheet/TPD2EUSB30DRTR-N/7109362.html; Supplier: LCSC; ConvertToPcb: yes; FootprintName: SOT-723_L1.2-W0.8-P0.40-LS1.2-BR; Peak Pulse Current (Ipp): 4A@8/20us; Peak Pulse Power Dissipation (Ppp): 56W@8/20us; Type: ESD
U7 = CH340C: 应用功能:收发器;USB协议版本:USB 2.0;数据速率:2Mbps;; Manufacturer: WCH(南京沁恒); AddInBom: yes; ModelId: 3361a6792abf4a8f8fbca4f1924a67ee聨0819f05c4eef4c71ace90d822a990e87; ModelName: SOP-16_L9.9-W3.9-H1.5-LS6.0-P1.27; ModelTransform: 240.39054,393.7,0,90,0,0,0,0,0; Applications Function: 收发器; USB Protocol: USB 2.0; Voltage - Supply: 3.3V；5V; Data Rate: 2Mbps; Current - Supply: 7mA; Supply Current (Iq): 50uA; Symbol: CH340C; Device: CH340C; LCSC Part Name: USB转串口芯片; SupplierPart: C84681; ManufacturerPart: CH340C; Supplier Footprint: SOP-16; JLCPCB Part Class: Extended Part; Datasheet: https://item.szlcsc.com/datasheet/CH340C/85852.html; Supplier: LCSC; ConvertToPcb: yes; FootprintName: SOP-16_L10.0-W3.9-P1.27-LS6.0-BL; Operating Temperature: -20℃~+70℃
U8 = AP2112K-3.3TRG1: 输出极性:正极;工作电压:6V;输出电压:3.3V;输出电流:600mA;电源纹波抑制比(PSRR):65dB@(1kHz);输出类型:固定;; Manufacturer: DIODES(美台); AddInBom: yes; ModelId: c0f94ce67e934acfa3fe33a5b88e2836聨0819f05c4eef4c71ace90d822a990e87; ModelTransform: 114.173,110.236,0,0,0,0,0,0,0; Output Configuration: 正极; Voltage - Supply: 6V; Output Voltage: 3.3V; Output Current: 600mA; Voltage Dropout: 250mV@(600mA); standby current: 55uA; Noise: 50uVrms; Output Type: 固定; Number of Outputs: 1; Symbol: AP2112K-3.3TRG1; Device: AP2112K-3.3TRG1; LCSC Part Name: 3.3V 600mA 6V; SupplierPart: C51118; ManufacturerPart: AP2112K-3.3TRG1; Supplier Footprint: SOT-25-5; JLCPCB Part Class: Extended Part; Datasheet: https://item.szlcsc.com/datasheet/AP2112K-3.3TRG1/52131.html; Supplier: LCSC; ConvertToPcb: yes; FootprintName: SOT-25-5_L2.9-W1.6-P0.95-LS2.8-BL; ModelName: SOT-25-5_L2.9-W1.6-P0.95-LS2.8-BL; Power Supply Rejection Ratio (PSRR): 65dB@(1kHz); Features: 使能控制；短路保护；输出放电；过流保护；热关断; Operating Temperature: -40℃~+85℃@(Ta)
USB1 = TYPE-C 16PIN 2MD(073): 连接器类型:Type-C;协议标准:-;公母:母;安装方式:卧贴;触点数量:16P;端口数量:1;额定电流 - 电源:3A;工作温度:-25℃~+85℃;; Manufacturer: SHOU HAN(首韩); AddInBom: yes; ModelId: 3a41b9ec9b654a0fad4d118405ec6290聨0819f05c4eef4c71ace90d822a990e87; ModelName: USB-C-SMD_TYPE-C-6PIN-2MD-073; ModelTransform: 351.9678,298.4246,0,0,0,0,0,-47.244,-35.433; Gender: 母; Number of Contacts: 16P; Number of Ports: 1; Current Rating-Power: 3A; Voltage Rating: 5V; Connect-Disconnect Life: 1万次; Detection color: 黑色; Symbol: TYPE-C 16PIN 2MD(073); Device: TYPE-C 16PIN 2MD(073); LCSC Part Name: Type-C 母 卧贴; SupplierPart: C2765186; ManufacturerPart: TYPE-C 16PIN 2MD(073); Supplier Footprint: SMD; JLCPCB Part Class: Extended Part; Datasheet: https://item.szlcsc.com/datasheet/TYPE-C%252016PIN%25202MD(073)/2901843.html; Supplier: LCSC; ConvertToPcb: yes; FootprintName: USB-C-SMD_TYPE-C-16PIN-2MD-073; Connector Type: Type-C; Protocol Standard: -; Mounting Type: 卧贴; Supplementary Features: -; Center Height: -; Length: -; Operating Temperature: -25℃~+85℃
X1 = XC53G2-8.000-F12NJHP: 晶振类型:贴片晶振;频率:8MHz;常温频差:±10ppm;负载电容:12pF;频率稳定度:±30ppm;; Manufacturer: HCI(杭晶); AddInBom: yes; ModelId: d7c39c66443246ff83c2003c1e1eb6f1聨0819f05c4eef4c71ace90d822a990e87; ModelTransform: 196.85,125.984,0,0,0,0,0,0,0; Normal temperature Frequency Tolerance: ±10ppm; Load Capacitance: 12pF; Frequency Stability: ±30ppm; Equivalent Series Resistance(ESR): 80Ω; Symbol: XC53G2-8.000-F12NJHP; Device: XC53G2-8.000-F12NJHP; LCSC Part Name: 5032 2P glass 8MHz 12pF ±10ppm -20℃~+70℃(±30ppm); SupplierPart: C2842269; ManufacturerPart: XC53G2-8.000-F12NJHP; Supplier Footprint: SMD5032-2P; JLCPCB Part Class: Extended Part; Datasheet: https://item.szlcsc.com/datasheet/XC53G2-8.000-F12NJHP/3026543.html; Supplier: LCSC; ConvertToPcb: yes; FootprintName: CRYSTAL-SMD_L5.0-W3.2; ModelName: CRYSTAL-SMD_L5.0-W3.2; Type: 贴片晶振; Value: 8MHz; Operating Temperature: -20℃~+70℃